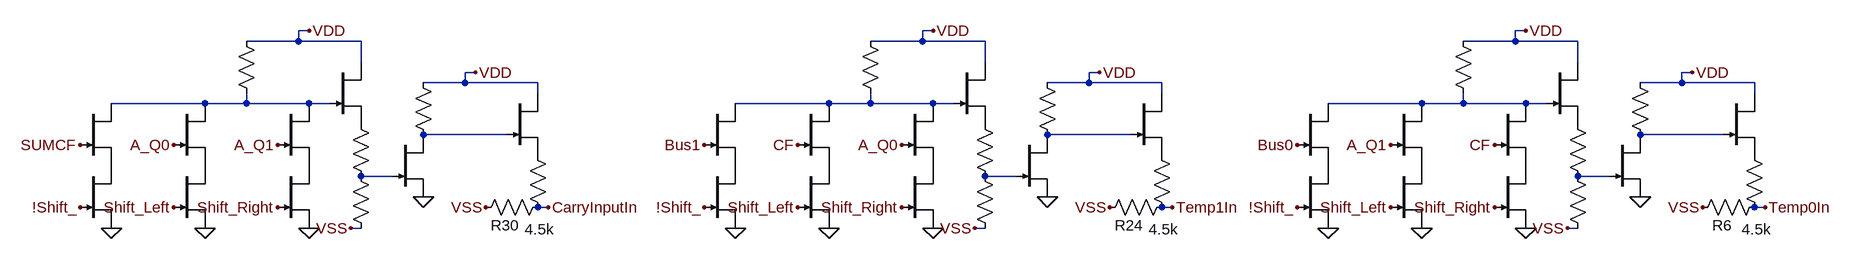
[diagram p0: schematic 2 bit.asc]
2 bit.asc, the LTspice schematic file:
Version 4.1
SHEET 1 109444 42780
WIRE -4192 4224 -4208 4224
WIRE -3232 4224 -3248 4224
WIRE -2320 4224 -2336 4224
WIRE -4208 4240 -4208 4224
WIRE -4208 4240 -4288 4240
WIRE -4112 4240 -4208 4240
WIRE -3248 4240 -3248 4224
WIRE -3248 4240 -3328 4240
WIRE -3152 4240 -3248 4240
WIRE -2336 4240 -2336 4224
WIRE -2336 4240 -2416 4240
WIRE -2240 4240 -2336 4240
WIRE -4112 4272 -4112 4240
WIRE -3152 4272 -3152 4240
WIRE -2240 4272 -2240 4240
WIRE -3936 4288 -3952 4288
WIRE -2976 4288 -2992 4288
WIRE -2064 4288 -2080 4288
WIRE -3952 4304 -3952 4288
WIRE -3952 4304 -4016 4304
WIRE -3840 4304 -3952 4304
WIRE -2992 4304 -2992 4288
WIRE -2992 4304 -3056 4304
WIRE -2880 4304 -2992 4304
WIRE -2080 4304 -2080 4288
WIRE -2080 4304 -2144 4304
WIRE -1968 4304 -2080 4304
WIRE -3840 4320 -3840 4304
WIRE -2880 4320 -2880 4304
WIRE -1968 4320 -1968 4304
WIRE -4352 4336 -4496 4336
WIRE -4288 4336 -4288 4320
WIRE -4288 4336 -4352 4336
WIRE -4192 4336 -4288 4336
WIRE -4160 4336 -4192 4336
WIRE -3392 4336 -3536 4336
WIRE -3328 4336 -3328 4320
WIRE -3328 4336 -3392 4336
WIRE -3232 4336 -3328 4336
WIRE -3200 4336 -3232 4336
WIRE -2480 4336 -2624 4336
WIRE -2416 4336 -2416 4320
WIRE -2416 4336 -2480 4336
WIRE -2320 4336 -2416 4336
WIRE -2288 4336 -2320 4336
WIRE -3888 4384 -4016 4384
WIRE -2928 4384 -3056 4384
WIRE -2016 4384 -2144 4384
WIRE -4064 4448 -4112 4448
WIRE -3104 4448 -3152 4448
WIRE -2192 4448 -2240 4448
WIRE -3824 4496 -3840 4496
WIRE -2864 4496 -2880 4496
WIRE -1952 4496 -1968 4496
WIRE -4112 4528 -4128 4528
WIRE -3152 4528 -3168 4528
WIRE -2240 4528 -2256 4528
FLAG -3232 4528 0
FLAG -3392 4528 0
FLAG -3056 4480 0
FLAG -3232 4224 VDD
FLAG -2976 4288 VDD
FLAG -3168 4528 VSS
FLAG -2960 4496 VSS
FLAG -3440 4496 Shift_Left
FLAG -3280 4496 Shift_Right
FLAG -3536 4528 0
FLAG -3584 4496 !Shift_
FLAG -3584 4400 Bus1
FLAG -3440 4400 CF
FLAG -4192 4528 0
FLAG -4352 4528 0
FLAG -4016 4480 0
FLAG -4192 4224 VDD
FLAG -3936 4288 VDD
FLAG -4128 4528 VSS
FLAG -3920 4496 VSS
FLAG -4400 4496 Shift_Left
FLAG -4240 4496 Shift_Right
FLAG -4496 4528 0
FLAG -4544 4496 !Shift_
FLAG -4240 4400 A_Q1
FLAG -2864 4496 Temp1In
FLAG -3824 4496 CarryInputIn
FLAG -4544 4400 SUMCF
FLAG -3280 4400 A_Q0
FLAG -4400 4400 A_Q0
FLAG -2320 4528 0
FLAG -2480 4528 0
FLAG -2144 4480 0
FLAG -2320 4224 VDD
FLAG -2064 4288 VDD
FLAG -2256 4528 VSS
FLAG -2048 4496 VSS
FLAG -2528 4496 Shift_Left
FLAG -2368 4496 Shift_Right
FLAG -2624 4528 0
FLAG -2672 4496 !Shift_
FLAG -2672 4400 Bus0
FLAG -2528 4400 A_Q1
FLAG -1952 4496 Temp0In
FLAG -2368 4400 CF
SYMBOL njf -3440 4336 R0
WINDOW 3 198 224 Invisible 2
WINDOW 0 56 32 Invisible 2
SYMATTR Value DR
SYMATTR InstName J_A19
SYMBOL res -3344 4224 R0
WINDOW 0 -35 57 Invisible 2
WINDOW 3 34 56 Invisible 2
SYMATTR InstName R19
SYMATTR Value 100k
SYMBOL njf -3200 4272 R0
WINDOW 0 56 32 Invisible 2
WINDOW 3 56 72 Invisible 2
SYMATTR InstName J_F4
SYMATTR Value DR
SYMBOL res -3168 4352 R0
WINDOW 0 -136 215 Invisible 2
WINDOW 3 34 58 Invisible 2
SYMATTR InstName R20
SYMATTR Value 1k
SYMBOL res -3168 4432 R0
WINDOW 0 -10 158 Invisible 2
WINDOW 3 37 62 Invisible 2
SYMATTR InstName R21
SYMATTR Value 4.8k
SYMBOL njf -3280 4336 R0
WINDOW 0 56 32 Invisible 2
WINDOW 3 56 72 Invisible 2
SYMATTR InstName J_B7
SYMATTR Value DR
SYMBOL njf -3104 4384 R0
WINDOW 0 56 32 Invisible 2
WINDOW 3 56 72 Invisible 2
SYMATTR InstName J_A20
SYMATTR Value DR
SYMBOL res -3072 4288 R0
WINDOW 0 56 32 Invisible 2
WINDOW 3 56 72 Invisible 2
SYMATTR InstName R22
SYMATTR Value 50k
SYMBOL njf -2928 4320 R0
WINDOW 0 56 32 Invisible 2
WINDOW 3 56 72 Invisible 2
SYMATTR InstName J_A21
SYMATTR Value DR
SYMBOL res -2896 4400 R0
WINDOW 0 37 24 Invisible 2
WINDOW 3 -30 25 Invisible 2
SYMATTR InstName R23
SYMATTR Value 1k
SYMBOL res -2864 4480 R90
WINDOW 0 59 66 VBottom 2
WINDOW 3 34 13 VTop 2
SYMATTR InstName R24
SYMATTR Value 4.5k
SYMBOL njf -3440 4432 R0
WINDOW 0 119 134 Invisible 2
WINDOW 3 131 136 Invisible 2
SYMATTR InstName J_A22
SYMATTR Value DR
SYMBOL njf -3280 4432 R0
WINDOW 3 -27 143 Invisible 2
WINDOW 0 56 32 Invisible 2
SYMATTR Value DR
SYMATTR InstName J_B8
SYMBOL njf -3584 4336 R0
WINDOW 0 63 15 Invisible 2
WINDOW 3 62 106 Invisible 2
SYMATTR InstName J_A23
SYMATTR Value DR
SYMBOL njf -3584 4432 R0
WINDOW 0 254 138 Invisible 2
WINDOW 3 277 142 Invisible 2
SYMATTR InstName J_A24
SYMATTR Value DR
SYMBOL njf -4400 4336 R0
WINDOW 3 198 224 Invisible 2
WINDOW 0 56 32 Invisible 2
SYMATTR Value DR
SYMATTR InstName J_A25
SYMBOL res -4304 4224 R0
WINDOW 0 -35 57 Invisible 2
WINDOW 3 34 56 Invisible 2
SYMATTR InstName R25
SYMATTR Value 100k
SYMBOL njf -4160 4272 R0
WINDOW 0 56 32 Invisible 2
WINDOW 3 56 72 Invisible 2
SYMATTR InstName J_F5
SYMATTR Value DR
SYMBOL res -4128 4352 R0
WINDOW 0 -136 215 Invisible 2
WINDOW 3 34 58 Invisible 2
SYMATTR InstName R26
SYMATTR Value 1k
SYMBOL res -4128 4432 R0
WINDOW 0 -10 158 Invisible 2
WINDOW 3 37 62 Invisible 2
SYMATTR InstName R27
SYMATTR Value 4.8k
SYMBOL njf -4240 4336 R0
WINDOW 0 56 32 Invisible 2
WINDOW 3 56 72 Invisible 2
SYMATTR InstName J_B9
SYMATTR Value DR
SYMBOL njf -4064 4384 R0
WINDOW 0 56 32 Invisible 2
WINDOW 3 56 72 Invisible 2
SYMATTR InstName J_A26
SYMATTR Value DR
SYMBOL res -4032 4288 R0
WINDOW 0 56 32 Invisible 2
WINDOW 3 56 72 Invisible 2
SYMATTR InstName R28
SYMATTR Value 50k
SYMBOL njf -3888 4320 R0
WINDOW 0 56 32 Invisible 2
WINDOW 3 56 72 Invisible 2
SYMATTR InstName J_A27
SYMATTR Value DR
SYMBOL res -3856 4400 R0
WINDOW 0 37 24 Invisible 2
WINDOW 3 -30 25 Invisible 2
SYMATTR InstName R29
SYMATTR Value 1k
SYMBOL res -3824 4480 R90
WINDOW 0 59 66 VBottom 2
WINDOW 3 34 13 VTop 2
SYMATTR InstName R30
SYMATTR Value 4.5k
SYMBOL njf -4400 4432 R0
WINDOW 0 119 134 Invisible 2
WINDOW 3 131 136 Invisible 2
SYMATTR InstName J_A28
SYMATTR Value DR
SYMBOL njf -4240 4432 R0
WINDOW 3 -27 143 Invisible 2
WINDOW 0 56 32 Invisible 2
SYMATTR Value DR
SYMATTR InstName J_B10
SYMBOL njf -4544 4336 R0
WINDOW 0 63 15 Invisible 2
WINDOW 3 62 106 Invisible 2
SYMATTR InstName J_A29
SYMATTR Value DR
SYMBOL njf -4544 4432 R0
WINDOW 0 254 138 Invisible 2
WINDOW 3 277 142 Invisible 2
SYMATTR InstName J_A30
SYMATTR Value DR
SYMBOL njf -2528 4336 R0
WINDOW 3 198 224 Invisible 2
WINDOW 0 56 32 Invisible 2
SYMATTR Value DR
SYMATTR InstName J_A1
SYMBOL res -2432 4224 R0
WINDOW 0 -35 57 Invisible 2
WINDOW 3 34 56 Invisible 2
SYMATTR InstName R1
SYMATTR Value 100k
SYMBOL njf -2288 4272 R0
WINDOW 0 56 32 Invisible 2
WINDOW 3 56 72 Invisible 2
SYMATTR InstName J_F1
SYMATTR Value DR
SYMBOL res -2256 4352 R0
WINDOW 0 -136 215 Invisible 2
WINDOW 3 34 58 Invisible 2
SYMATTR InstName R2
SYMATTR Value 1k
SYMBOL res -2256 4432 R0
WINDOW 0 -10 158 Invisible 2
WINDOW 3 37 62 Invisible 2
SYMATTR InstName R3
SYMATTR Value 4.8k
SYMBOL njf -2368 4336 R0
WINDOW 0 56 32 Invisible 2
WINDOW 3 56 72 Invisible 2
SYMATTR InstName J_B1
SYMATTR Value DR
SYMBOL njf -2192 4384 R0
WINDOW 0 56 32 Invisible 2
WINDOW 3 56 72 Invisible 2
SYMATTR InstName J_A2
SYMATTR Value DR
SYMBOL res -2160 4288 R0
WINDOW 0 56 32 Invisible 2
WINDOW 3 56 72 Invisible 2
SYMATTR InstName R4
SYMATTR Value 50k
SYMBOL njf -2016 4320 R0
WINDOW 0 56 32 Invisible 2
WINDOW 3 56 72 Invisible 2
SYMATTR InstName J_A3
SYMATTR Value DR
SYMBOL res -1984 4400 R0
WINDOW 0 37 24 Invisible 2
WINDOW 3 -30 25 Invisible 2
SYMATTR InstName R5
SYMATTR Value 1k
SYMBOL res -1952 4480 R90
WINDOW 0 59 66 VBottom 2
WINDOW 3 34 13 VTop 2
SYMATTR InstName R6
SYMATTR Value 4.5k
SYMBOL njf -2528 4432 R0
WINDOW 0 119 134 Invisible 2
WINDOW 3 131 136 Invisible 2
SYMATTR InstName J_A4
SYMATTR Value DR
SYMBOL njf -2368 4432 R0
WINDOW 3 -27 143 Invisible 2
WINDOW 0 56 32 Invisible 2
SYMATTR Value DR
SYMATTR InstName J_B2
SYMBOL njf -2672 4336 R0
WINDOW 0 63 15 Invisible 2
WINDOW 3 62 106 Invisible 2
SYMATTR InstName J_A5
SYMATTR Value DR
SYMBOL njf -2672 4432 R0
WINDOW 0 254 138 Invisible 2
WINDOW 3 277 142 Invisible 2
SYMATTR InstName J_A6
SYMATTR Value DR

The netlist it stands for:
* 2 bit.asc
J_A19 N002 CF P001 DR
R19 VDD N002 100k
J_F4 VDD N002 P002 DR
R20 P002 N008 1k
R21 N008 VSS 4.8k
J_B7 N002 A_Q0 P003 DR
J_A20 N005 N008 0 DR
R22 VDD N005 50k
J_A21 VDD N005 P004 DR
R23 P004 Temp1In 1k
R24 Temp1In VSS 4.5k
J_A22 P001 Shift_Left 0 DR
J_B8 P003 Shift_Right 0 DR
J_A23 N002 Bus1 P005 DR
J_A24 P005 !Shift_ 0 DR
J_A25 N001 A_Q0 P006 DR
R25 VDD N001 100k
J_F5 VDD N001 P007 DR
R26 P007 N007 1k
R27 N007 VSS 4.8k
J_B9 N001 A_Q1 P008 DR
J_A26 N004 N007 0 DR
R28 VDD N004 50k
J_A27 VDD N004 P009 DR
R29 P009 CarryInputIn 1k
R30 CarryInputIn VSS 4.5k
J_A28 P006 Shift_Left 0 DR
J_B10 P008 Shift_Right 0 DR
J_A29 N001 SUMCF P010 DR
J_A30 P010 !Shift_ 0 DR
J_A1 N003 A_Q1 P011 DR
R1 VDD N003 100k
J_F1 VDD N003 P012 DR
R2 P012 N009 1k
R3 N009 VSS 4.8k
J_B1 N003 CF P013 DR
J_A2 N006 N009 0 DR
R4 VDD N006 50k
J_A3 VDD N006 P014 DR
R5 P014 Temp0In 1k
R6 Temp0In VSS 4.5k
J_A4 P011 Shift_Left 0 DR
J_B2 P013 Shift_Right 0 DR
J_A5 N003 Bus0 P015 DR
J_A6 P015 !Shift_ 0 DR
.model NJF NJF
.model PJF PJF
.lib standard.jft
.backanno
.end